# Altium schematic sheet PD_Controll_and_LEDs.SchDoc: Manual Controll & LEDs
size 292 x 193 mm; SheetNumber: 6; SheetTotal: 11; SheetSize: A4
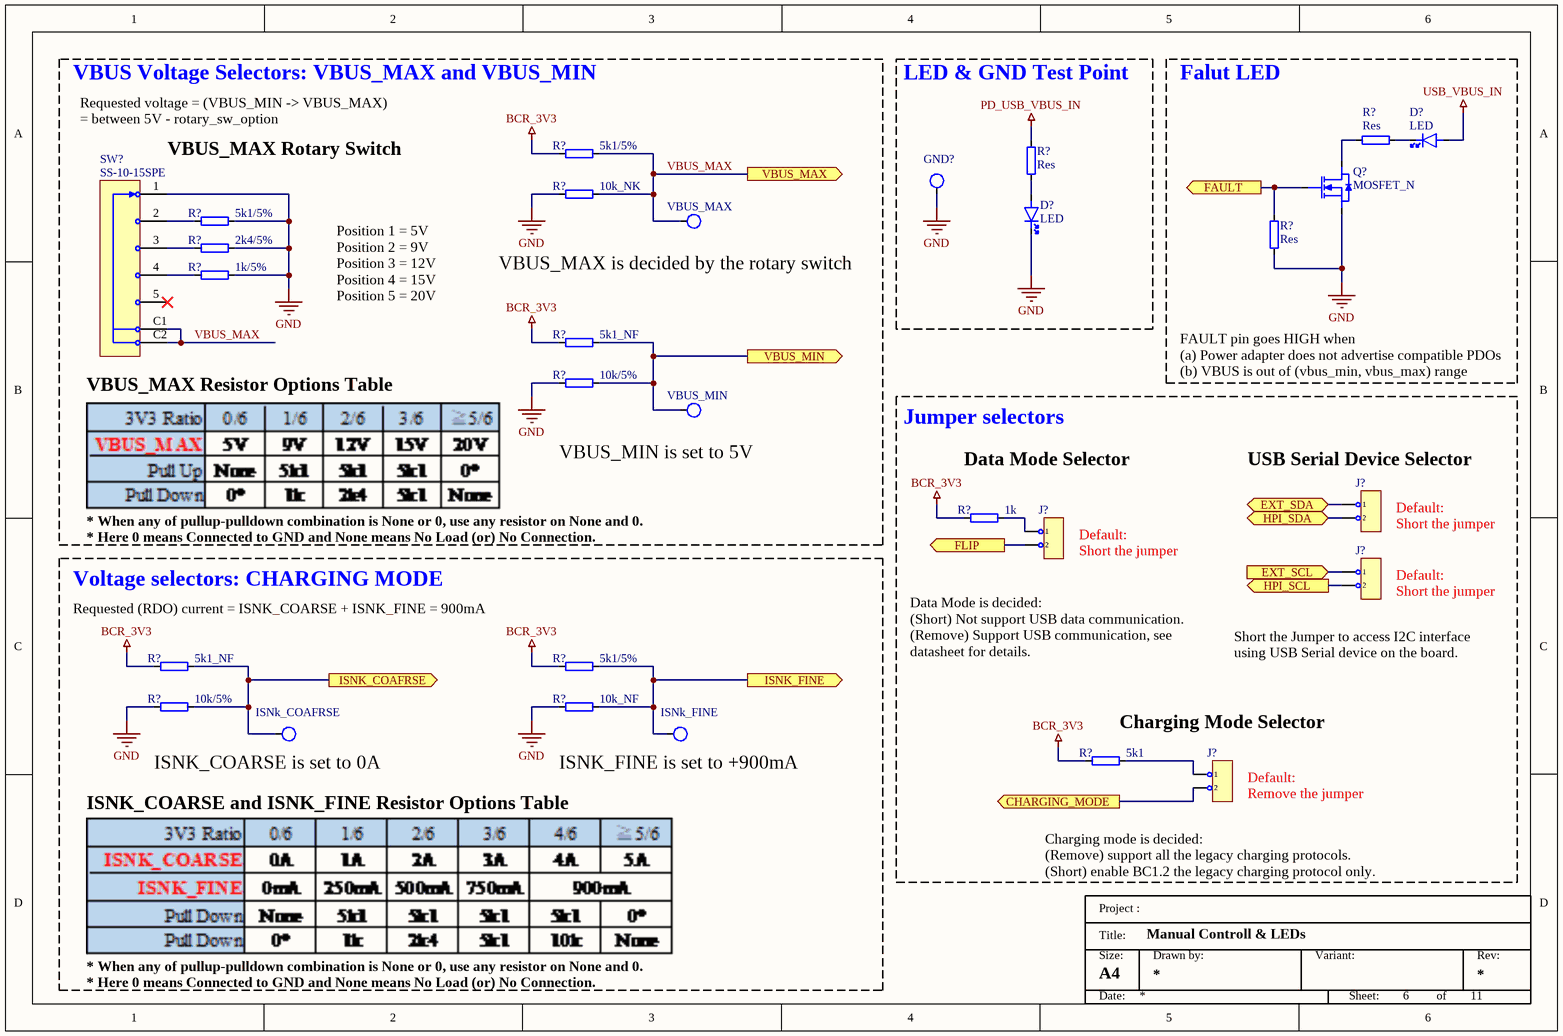
[diagram p0: PD_Controll_and_LEDs.SchDoc]

## Parts
(Parts that share a designator on the sheet are numbered #1, #2 ... from top to bottom, then left to right.)
D?#1  LED  [0603_LED]
D?#2  LED  [0603_LED]
GND?  DIP_small_Black  [TestPoint_dip_big]  (value not drawn)
ISNk_COAFRSE  SMD_25mil  [TestPoint_dip_big]  (value not drawn)
ISNk_FINE  SMD_25mil  [TestPoint_dip_big]  (value not drawn)
J?#1  Jumper_2x1  [Dupont_Header_(Female)_2.54_2x1]  (value not drawn)
J?#2  Jumper_2x1  [Dupont_Header_(Female)_2.54_2x1]  (value not drawn)
J?#3  Jumper_2x1  [Dupont_Header_(Female)_2.54_2x1]  (value not drawn)
J?#4  Jumper_2x1  [Dupont_Header_(Female)_2.54_2x1]  (value not drawn)
Q?  MOSFET_N  [SOT-523-3]
R?#1  Res  [0603_Res]
R?#2  Res  [0603_Res]
R?#3  5k1/5%  [0603_Res]
R?#4  10k_NK  [0603_Res]
R?#5  Res  [0603_Res]
R?#6  5k1/5%  [0603_Res]
R?#7  2k4/5%  [0603_Res]
R?#8  1k/5%  [0603_Res]
R?#9  5k1_NF  [0603_Res]
R?#10  10k/5%  [0603_Res]
R?#11  1k  [0603_Res]
R?#12  5k1_NF  [0603_Res]
R?#13  5k1/5%  [0603_Res]
R?#14  10k/5%  [0603_Res]
R?#15  10k_NF  [0603_Res]
R?#16  5k1  [0603_Res]
SW?  SS-10-15SPE
VBUS_MAX  SMD_25mil  [TestPoint_dip_big]  (value not drawn)
VBUS_MIN  SMD_25mil  [TestPoint_dip_big]  (value not drawn)

## Blocks framed on the sheet
VBUS Voltage Selectors: VBUS_MAX and VBUS_MIN: R?#3 R?#4 R?#6-R?#10 SW? VBUS_MAX VBUS_MIN
LED & GND Test Point: D?#2 GND? R?#1
Falut LED: D?#1 Q? R?#2 R?#5
Jumper selectors: J?#1-J?#4 R?#11 R?#16
Voltage selectors: CHARGING MODE: ISNk_COAFRSE ISNk_FINE R?#12-R?#15

## Ports
CHARGING_MODE (out), EXT_SCL (in), EXT_SDA (bidir), FAULT (out), FLIP (out), HPI_SCL (out), HPI_SDA (bidir), ISNK_COAFRSE (out), ISNK_FINE (out), VBUS_MAX (out), VBUS_MIN (out)

## Nets
BCR_3V3: R?#3.1 R?#9.1 R?#11.1 R?#12.1 R?#13.1 R?#16.1
GND: D?#2.2(K) GND?.1 Q?.3(S) R?#4.1 R?#5.2 R?#6.2 R?#7.2 R?#8.2 R?#10.1 R?#14.1 R?#15.1 SW?.1
PD_USB_VBUS_IN: R?#1.1
USB_VBUS_IN: D?#1.1(A)
CHARGING_MODE: J?#4.2 ; port CHARGING_MODE
EXT_SCL: J?#3.1 ; port EXT_SCL
EXT_SDA: J?#1.1 ; port EXT_SDA
FAULT: Q?.2(G) R?#5.1 ; port FAULT
FLIP: J?#2.2 ; port FLIP
HPI_SCL: J?#3.2 ; port HPI_SCL
HPI_SDA: J?#1.2 ; port HPI_SDA
ISNK_COAFRSE: ISNk_COAFRSE.1 R?#12.2 R?#14.2 ; port ISNK_COAFRSE
ISNK_FINE: ISNk_FINE.1 R?#13.2 R?#15.2 ; port ISNK_FINE
VBUS_MAX: R?#3.2 R?#4.2 SW?.C1 SW?.C2 VBUS_MAX.1 ; port VBUS_MAX
VBUS_MIN: R?#9.2 R?#10.2 VBUS_MIN.1 ; port VBUS_MIN
NetD?#1_2: D?#1.2(K) R?#2.1
NetD?#2_1: D?#2.1(A) R?#1.2
NetJ?#2_1: J?#2.1 R?#11.2
NetJ?#4_1: J?#4.1 R?#16.2
NetQ?_1: Q?.1(D) R?#2.2
NetR?#6_1: R?#6.1 SW?.2
NetR?#7_1: R?#7.1 SW?.3
NetR?#8_1: R?#8.1 SW?.4

Not connected (* = marked no-connect by the designer): SW? 5*

## Notes on the sheet
- Requested voltage = (VBUS_MIN -> VBUS_MAX)
  = between 5V - rotary_sw_option
- VBUS_MAX Rotary Switch
- Position 1 = 5V
  Position 2 = 9V
  Position 3 = 12V
  Position 4 = 15V
  Position 5 = 20V
- (near VBUS_MAX) VBUS_MAX is decided by the rotary switch
- FAULT pin goes HIGH when
  (a) Power adapter does not advertise compatible PDOs
  (b) VBUS is out of (vbus_min, vbus_max) range
- (near SW?) VBUS_MAX Resistor Options Table
- (near VBUS_MIN) VBUS_MIN is set to 5V
- Data Mode Selector
- (near J?#1) USB Serial Device Selector
- * When any of pullup-pulldown combination is None or 0, use any resistor on None and 0.
  * Here 0 means Connected to GND and None means No Load (or) No Connection.
- (near J?#2) Default:
  Short the jumper
- (near J?#1) Default:
  Short the jumper
- (near R?#12) Requested (RDO) current = ISNK_COARSE + ISNK_FINE = 900mA
- Data Mode is decided:
  (Short) Not support USB data communication.
  (Remove) Support USB communication, see datasheet for details.
- (near J?#3) Short the Jumper to access I2C interface using USB Serial device on the board.
- (near J?#3) Default:
  Short the jumper
- (near ISNk_COAFRSE) ISNK_COARSE is set to 0A
- (near ISNk_FINE) ISNK_FINE is set to +900mA
- Charging Mode Selector
- ISNK_COARSE and ISNK_FINE Resistor Options Table
- (near J?#4) Default:
  Remove the jumper
- (near J?#4) Charging mode is decided:
  (Remove) support all the legacy charging protocols.
  (Short) enable BC1.2 the legacy charging protocol only.
- Project :
- Size:
- Title:
- Drawn by:
- Variant:
- Rev:
- Date:
- Sheet:
- of

## Library data of the parts
D?#1 D?#2 = LED: General LED; Mfr. #: *; Mfr.: *; Distributor_Link: *; Datasheet: *; Distributor #: *
GND? ISNk_COAFRSE ISNk_FINE VBUS_MAX VBUS_MIN = Test_Point: General test point; Mfr. #: N/A; Mfr.: N/A; Distributor_Link: N/A; Datasheet: N/A; Distributor #: N/A
J?#1-J?#4 = Jumper_2x1: General Jumper 2x1; Mfr. #: *; Mfr.: *; Distributor_Link: *; Datasheet: *; Distributor #: *
Q? = MOSFET_N: General n channel mosfet; Mfr. #: *; Mfr.: *; Distributor_Link: *; Datasheet: *; Distributor #: *
R?#1-R?#16 = Res: General Resistor; Mfr. #: *; Mfr.: *; Distributor_Link: *; Datasheet: *; Distributor #: *
SW? = SS-10-15SPE: SW-SP5T